# EAGLE design STM32L4xx-v1.2.0 (EAGLE 9.3.1)

## Sheet 1 of 2
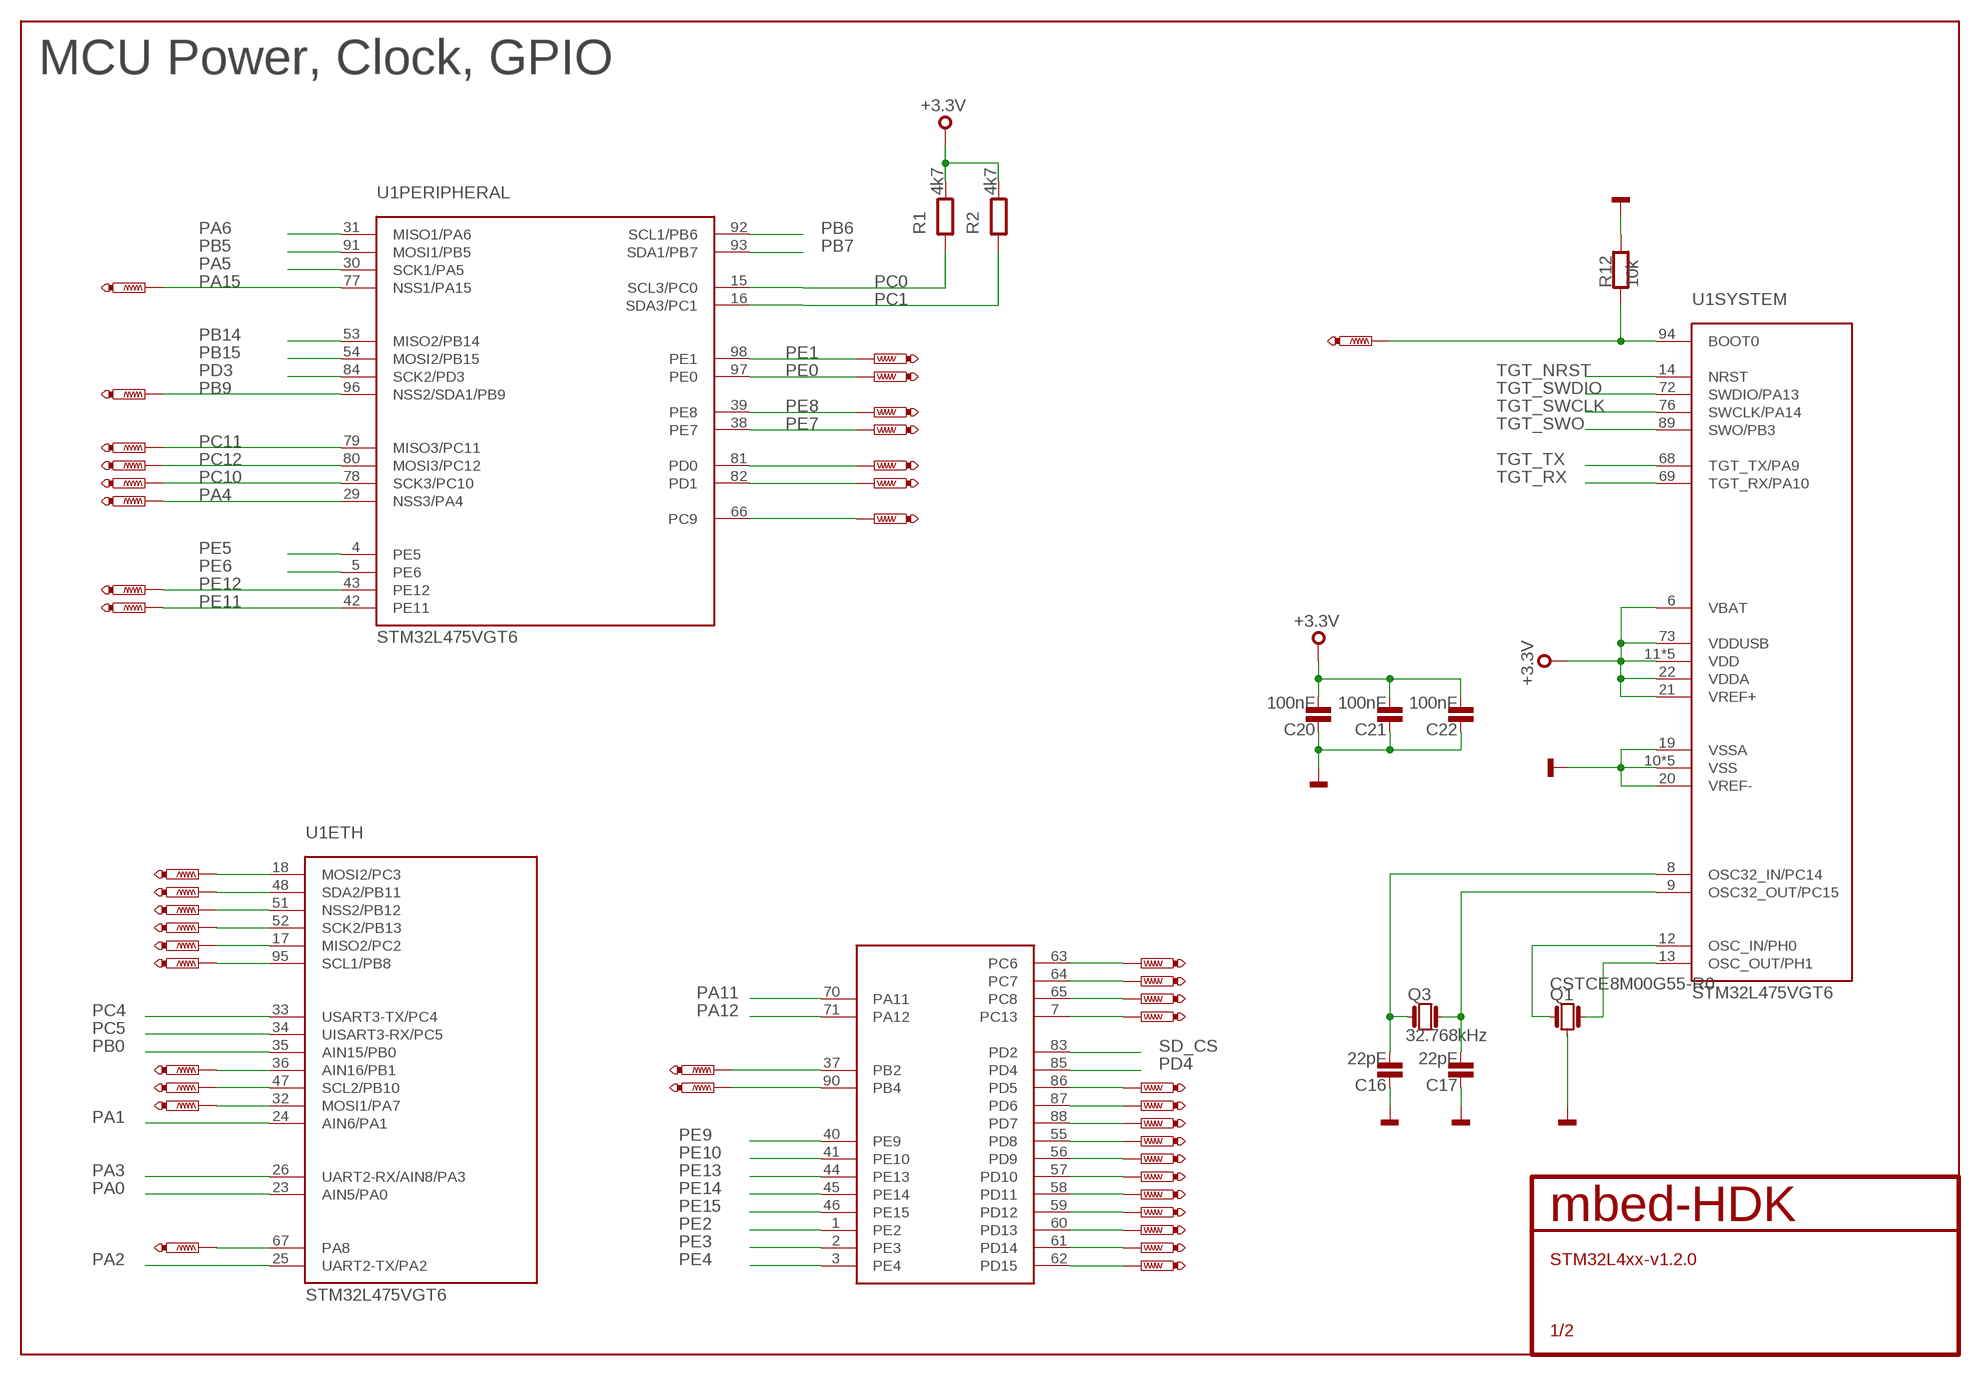
[diagram p0: schematic, sheet 1]

### Parts
C16  22pF  C0603  [0603]
C17  22pF  C0603  [0603]
C20  100nF  C0402  [0402]
C21  100nF  C0402  [0402]
C22  100nF  C0402  [0402]
Q1  CSTCE8M00G55-R0  [CSTCE8M00G55-R0]
Q3  32.768kHz  GENERIC-CRYSTAL_FC135  [FC135]
R1  4k7  R0402  [0402]
R2  4k7  R0402  [0402]
R12  10k  R0402  [0402]
TP3  PTR1TP06R  [TP06R]
TP4  PTR1TP06R  [TP06R]
TP5  PTR1TP06R  [TP06R]
TP6  PTR1TP06R  [TP06R]
TP7  PTR1TP06R  [TP06R]
TP8  PTR1TP06R  [TP06R]
TP9  PTR1TP06R  [TP06R]
TP10  PTR1TP06R  [TP06R]
TP11  PTR1TP06R  [TP06R]
TP12  PTR1TP06R  [TP06R]
TP13  PTR1TP06R  [TP06R]
TP14  PTR1TP06R  [TP06R]
TP15  PTR1TP06R  [TP06R]
TP16  PTR1TP06R  [TP06R]
TP17  PTR1TP06R  [TP06R]
TP18  PTR1TP06R  [TP06R]
TP19  PTR1TP06R  [TP06R]
TP20  PTR1TP06R  [TP06R]
TP21  PTR1TP06R  [TP06R]
TP22  PTR1TP06R  [TP06R]
TP23  PTR1TP06R  [TP06R]
TP24  PTR1TP06R  [TP06R]
TP25  PTR1TP06R  [TP06R]
TP26  PTR1TP06R  [TP06R]
TP27  PTR1TP06R  [TP06R]
TP28  PTR1TP06R  [TP06R]
TP29  PTR1TP06R  [TP06R]
TP30  PTR1TP06R  [TP06R]
TP31  PTR1TP06R  [TP06R]
TP32  PTR1TP06R  [TP06R]
TP33  PTR1TP06R  [TP06R]
TP34  PTR1TP06R  [TP06R]
TP35  PTR1TP06R  [TP06R]
TP36  PTR1TP06R  [TP06R]
TP37  PTR1TP06R  [TP06R]
TP38  PTR1TP06R  [TP06R]
TP39  PTR1TP06R  [TP06R]
TP40  PTR1TP06R  [TP06R]
TP41  PTR1TP06R  [TP06R]
TP42  PTR1TP06R  [TP06R]
TP43  PTR1TP06R  [TP06R]
TP44  PTR1TP06R  [TP06R]
TP45  PTR1TP06R  [TP06R]
U1  STM32L475VGT6  [QFP50P1600X1600X160-100N]

### Nets
+3.3V: C20.2 C21.2 C22.2 R1.2 R2.2 U1.6(SYSTEM:VBAT) U1.11(SYSTEM:VDD) U1.21(SYSTEM:VREF+) U1.22(SYSTEM:VDDA) U1.28(SYSTEM:VDD) U1.50(SYSTEM:VDD) U1.73(SYSTEM:VDDUSB) U1.75(SYSTEM:VDD) U1.100(SYSTEM:VDD) ; also sheet 2
GND: C16.1 C17.1 C20.1 C21.1 C22.1 Q1.2 R12.2 U1.10(SYSTEM:VSS) U1.19(SYSTEM:VSSA) U1.20(SYSTEM:VREF-) U1.27(SYSTEM:VSS) U1.49(SYSTEM:VSS) U1.74(SYSTEM:VSS) U1.99(SYSTEM:VSS) ; also sheet 2
N$1: TP5.TP U1.55(GPIO:PD8)
N$2: TP21.TP U1.62(GPIO:PD15)
N$3: R12.1 TP6.TP U1.94(SYSTEM:BOOT0)
N$4: TP26.TP U1.37(GPIO:PB2)
N$5: TP25.TP U1.7(GPIO:PC13)
N$6: TP27.TP U1.18(ETH:MOSI2/PC3)
N$7: TP28.TP U1.48(ETH:SDA2/PB11)
N$8: TP3.TP U1.81(PERIPHERAL:PD0)
N$9: TP29.TP U1.51(ETH:NSS2/PB12)
N$10: TP30.TP U1.52(ETH:SCK2/PB13)
N$11: Q1.1 U1.12(SYSTEM:OSC_IN/PH0)
N$12: Q1.3 U1.13(SYSTEM:OSC_OUT/PH1)
N$13: C17.2 Q3.X2 U1.9(SYSTEM:OSC32_OUT/PC15)
N$14: TP31.TP U1.17(ETH:MISO2/PC2)
N$15: C16.2 Q3.X1 U1.8(SYSTEM:OSC32_IN/PC14)
N$16: TP4.TP U1.82(PERIPHERAL:PD1)
N$17: TP7.TP U1.66(PERIPHERAL:PC9)
N$18: TP32.TP U1.95(ETH:SCL1/PB8)
N$19: TP33.TP U1.67(ETH:PA8)
N$20: TP18.TP U1.88(GPIO:PD7)
N$21: TP11.TP U1.90(GPIO:PB4)
N$22: TP34.TP U1.36(ETH:AIN16/PB1)
N$23: TP20.TP U1.86(GPIO:PD5)
N$24: TP19.TP U1.87(GPIO:PD6)
N$25: TP17.TP U1.65(GPIO:PC8)
N$26: TP16.TP U1.64(GPIO:PC7)
N$27: TP36.TP U1.47(ETH:SCL2/PB10)
N$28: TP15.TP U1.63(GPIO:PC6)
N$29: TP12.TP U1.60(GPIO:PD13)
N$30: TP35.TP U1.32(ETH:MOSI1/PA7)
N$31: TP13.TP U1.56(GPIO:PD9)
N$32: TP10.TP U1.57(GPIO:PD10)
N$34: TP22.TP U1.58(GPIO:PD11)
N$35: TP23.TP U1.59(GPIO:PD12)
N$36: TP24.TP U1.61(GPIO:PD14)
PA0: U1.23(ETH:AIN5/PA0) ; also sheet 2
PA1: U1.24(ETH:AIN6/PA1) ; also sheet 2
PA2: U1.25(ETH:UART2-TX/PA2) ; also sheet 2
PA3: U1.26(ETH:UART2-RX/AIN8/PA3) ; also sheet 2
PA4: TP44.TP U1.29(PERIPHERAL:NSS3/PA4)
PA5: U1.30(PERIPHERAL:SCK1/PA5) ; also sheet 2
PA6: U1.31(PERIPHERAL:MISO1/PA6) ; also sheet 2
PA11: U1.70(GPIO:PA11) ; also sheet 2
PA12: U1.71(GPIO:PA12) ; also sheet 2
PA15: TP37.TP U1.77(PERIPHERAL:NSS1/PA15)
PB0: U1.35(ETH:AIN15/PB0) ; also sheet 2
PB5: U1.91(PERIPHERAL:MOSI1/PB5) ; also sheet 2
PB6: U1.92(PERIPHERAL:SCL1/PB6) ; also sheet 2
PB7: U1.93(PERIPHERAL:SDA1/PB7) ; also sheet 2
PB9: TP14.TP U1.96(PERIPHERAL:NSS2/SDA1/PB9)
PB14: U1.53(PERIPHERAL:MISO2/PB14) ; also sheet 2
PB15: U1.54(PERIPHERAL:MOSI2/PB15) ; also sheet 2
PC0: R1.1 U1.15(PERIPHERAL:SCL3/PC0) ; also sheet 2
PC1: R2.1 U1.16(PERIPHERAL:SDA3/PC1) ; also sheet 2
PC4: U1.33(ETH:USART3-TX/PC4) ; also sheet 2
PC5: U1.34(ETH:UISART3-RX/PC5) ; also sheet 2
PC10: TP43.TP U1.78(PERIPHERAL:SCK3/PC10) ; also sheet 2
PC11: TP41.TP U1.79(PERIPHERAL:MISO3/PC11)
PC12: TP42.TP U1.80(PERIPHERAL:MOSI3/PC12)
PD3: U1.84(PERIPHERAL:SCK2/PD3) ; also sheet 2
PD4: U1.85(GPIO:PD4) ; also sheet 2
PE0: TP39.TP U1.97(PERIPHERAL:PE0)
PE1: TP38.TP U1.98(PERIPHERAL:PE1)
PE2: U1.1(GPIO:PE2) ; also sheet 2
PE3: U1.2(GPIO:PE3) ; also sheet 2
PE4: U1.3(GPIO:PE4) ; also sheet 2
PE5: U1.4(PERIPHERAL:PE5) ; also sheet 2
PE6: U1.5(PERIPHERAL:PE6) ; also sheet 2
PE7: TP45.TP U1.38(PERIPHERAL:PE7)
PE8: TP40.TP U1.39(PERIPHERAL:PE8)
PE9: U1.40(GPIO:PE9) ; also sheet 2
PE10: U1.41(GPIO:PE10) ; also sheet 2
PE11: TP8.TP U1.42(PERIPHERAL:PE11)
PE12: TP9.TP U1.43(PERIPHERAL:PE12)
PE13: U1.44(GPIO:PE13) ; also sheet 2
PE14: U1.45(GPIO:PE14) ; also sheet 2
PE15: U1.46(GPIO:PE15) ; also sheet 2
SD_CS: U1.83(GPIO:PD2) ; also sheet 2
TGT_NRST: U1.14(SYSTEM:NRST) ; also sheet 2
TGT_RX: U1.69(SYSTEM:TGT_RX/PA10) ; also sheet 2
TGT_SWCLK: U1.76(SYSTEM:SWCLK/PA14) ; also sheet 2
TGT_SWDIO: U1.72(SYSTEM:SWDIO/PA13) ; also sheet 2
TGT_SWO: U1.89(SYSTEM:SWO/PB3) ; also sheet 2
TGT_TX: U1.68(SYSTEM:TGT_TX/PA9) ; also sheet 2

### Notes on the sheet
- MCU Power, Clock, GPIO

## Sheet 2 of 2
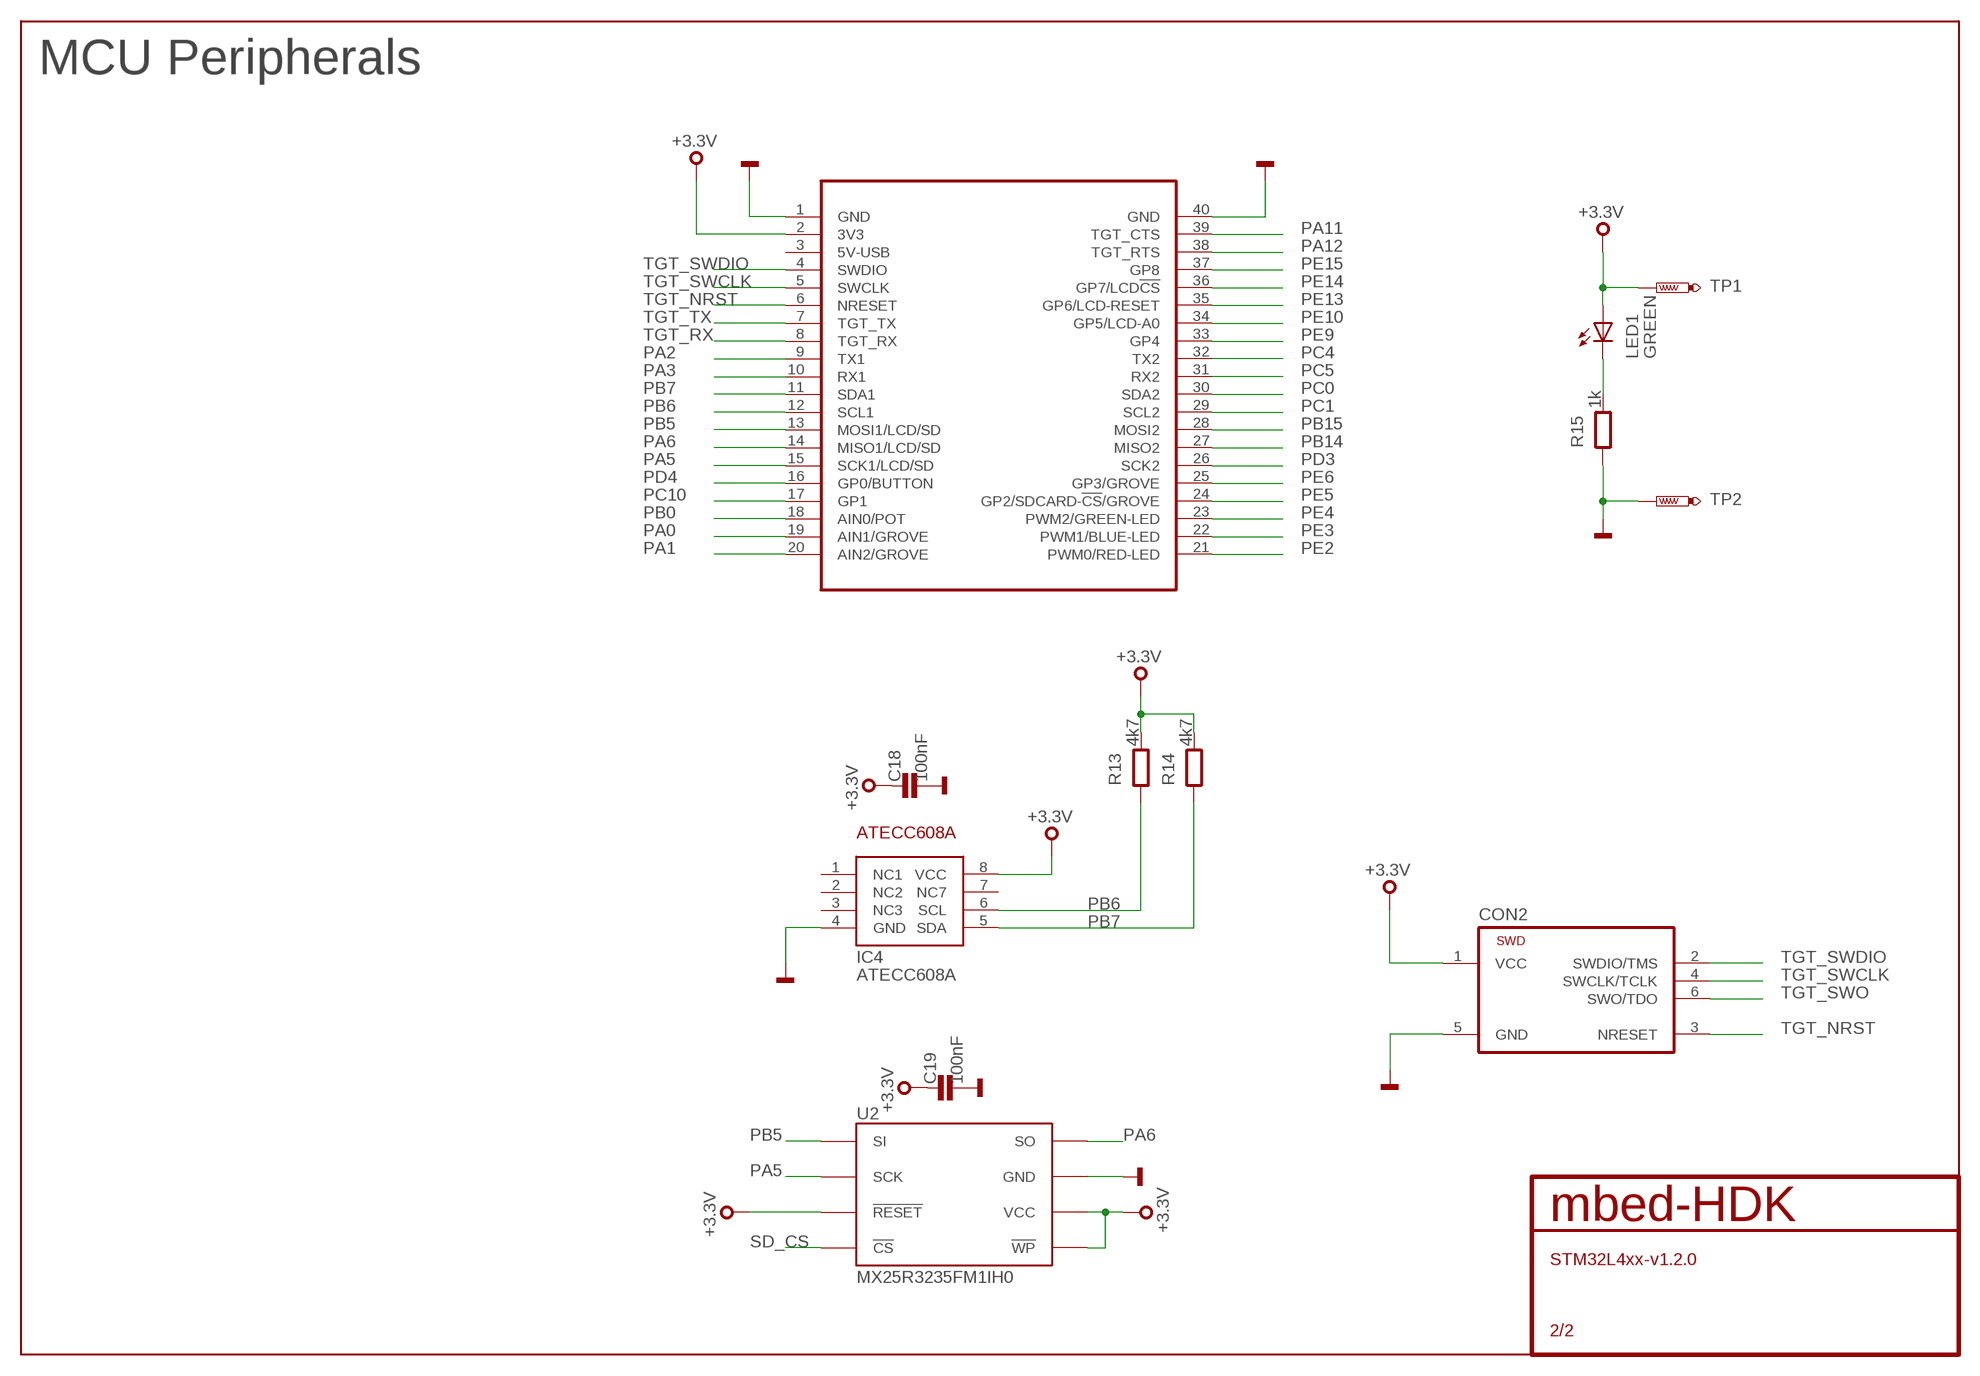
[diagram p1: schematic, sheet 2]

### Parts
C18  100nF  C0402  [0402]
C19  100nF  C0402  [0402]
CON2  TC2030-CTX-NL  [TC2030-CTX-NL]
IC4  ATECC608A  [SO8]
LED1  GREEN  SMD_LED0603  [CHIPLED_0603]
MOD1  MODULE_DAUGHTER  [MODULE_DAUGHTER]
R13  4k7  R0402  [0402]
R14  4k7  R0402  [0402]
R15  1k  R0603  [0603]
TP1  TEST_POINT-50R-PTH  [TP50-PTH]
TP2  TEST_POINT-50R-PTH  [TP50-PTH]
U2  MX25R3235FM1IH0  [SO8]

### Nets
+3.3V: C18.1 C19.1 CON2.1(VCC) IC4.8(VCC) LED1.A MOD1.2(3V3) R13.2 R14.2 TP1.TP U2.3(!WP) U2.7(!RESET) U2.8(VCC) ; also sheet 1
GND: C18.2 C19.2 CON2.5(GND) IC4.4(GND) MOD1.1(GND) MOD1.40(GND) R15.1 TP2.TP U2.4(GND) ; also sheet 1
PA0: MOD1.19(AIN1/GROVE) ; also sheet 1
PA1: MOD1.20(AIN2/GROVE) ; also sheet 1
PA2: MOD1.9(TX1) ; also sheet 1
PA3: MOD1.10(RX1) ; also sheet 1
PA5: MOD1.15(SCK1/LCD/SD) U2.6(SCK) ; also sheet 1
PA6: MOD1.14(MISO1/LCD/SD) U2.2(SO) ; also sheet 1
PA11: MOD1.39(TGT_CTS) ; also sheet 1
PA12: MOD1.38(TGT_RTS) ; also sheet 1
PA_1: LED1.C R15.2
PB0: MOD1.18(AIN0/POT) ; also sheet 1
PB5: MOD1.13(MOSI1/LCD/SD) U2.5(SI) ; also sheet 1
PB6: IC4.6(SCL) MOD1.12(SCL1) R13.1 ; also sheet 1
PB7: IC4.5(SDA) MOD1.11(SDA1) R14.1 ; also sheet 1
PB14: MOD1.27(MISO2) ; also sheet 1
PB15: MOD1.28(MOSI2) ; also sheet 1
PC0: MOD1.30(SDA2) ; also sheet 1
PC1: MOD1.29(SCL2) ; also sheet 1
PC4: MOD1.32(TX2) ; also sheet 1
PC5: MOD1.31(RX2) ; also sheet 1
PC10: MOD1.17(GP1) ; also sheet 1
PD3: MOD1.26(SCK2) ; also sheet 1
PD4: MOD1.16(GP0/BUTTON) ; also sheet 1
PE2: MOD1.21(PWM0/RED-LED) ; also sheet 1
PE3: MOD1.22(PWM1/BLUE-LED) ; also sheet 1
PE4: MOD1.23(PWM2/GREEN-LED) ; also sheet 1
PE5: MOD1.24(GP2/SDCARD-!CS!/GROVE) ; also sheet 1
PE6: MOD1.25(GP3/GROVE) ; also sheet 1
PE9: MOD1.33(GP4) ; also sheet 1
PE10: MOD1.34(GP5/LCD-A0) ; also sheet 1
PE13: MOD1.35(GP6/LCD-RESET) ; also sheet 1
PE14: MOD1.36(GP7/LCD!CS) ; also sheet 1
PE15: MOD1.37(GP8) ; also sheet 1
SD_CS: U2.1(!CS) ; also sheet 1
TGT_NRST: CON2.3(NRESET) MOD1.6(NRESET) ; also sheet 1
TGT_RX: MOD1.8(TGT_RX) ; also sheet 1
TGT_SWCLK: CON2.4(SWCLK/TCLK) MOD1.5(SWCLK) ; also sheet 1
TGT_SWDIO: CON2.2(SWDIO/TMS) MOD1.4(SWDIO) ; also sheet 1
TGT_SWO: CON2.6(SWO/TDO) ; also sheet 1
TGT_TX: MOD1.7(TGT_TX) ; also sheet 1
Unconnected: IC4.1(NC1) IC4.2(NC2) IC4.3(NC3) IC4.7(NC7) MOD1.3(5V-USB)

### Notes on the sheet
- MCU Peripherals

## Library data of the parts
C16-C22 = mbed-HDK-RLC:C: Capacitor
CON2 = mbed-HDK-Connector:TC2030-CTX: Tag-Connect In Circuit Programming & Debug Cable 6 Pin
IC4 = mbed-HDK-MF-ATMEL:ATECC608A
LED1 = mbed-HDK-Optical:SMD_LED: LED SMD, Colour Red; MF: Wurth Electronics Inc; MFN: 150060RS75000; OC-DIGIKEY: 732-4978-1-ND; OC-MOUSER: 710-150060RS75000; OC-NEWARK: 2322071
MOD1 = mbed-HDK-misc-Board:MODULE_DAUGHTER
Q1 = mbed-HDK-Oscillator:CSTCE8M00G55-R0: Resonator Cermanic, Murata 8MHz 33pF; MF: Murata; MFN: CSTCE8M00G55-R0; OC-DIGIKEY: 490-1195-1-ND; OC-MOUSER: 81-CSTCE8M00G55-R0; OC-NEWARK: 2443270
Q3 = mbed-HDK-Oscillator:GENERIC-CRYSTAL: GENERIC Crystal
R1 R2 R12-R15 = mbed-HDK-RLC:R: Resistor
TP1 TP2 = mbed-HDK-Test:TEST_POINT
TP3-TP45 = mbed-HDK-Test:PTR1: TEST PIN
U1 = SnapEDA:STM32L475VGT6
U2 = mbed-HDK-IC:MX25R3235FM1IH0: Serial Flash 32 Mb 80 Mhz; MF: Macronix; MFN: MX25R3235FM1IH0; OC-DIGIKEY: 1092-1175-ND

## Board
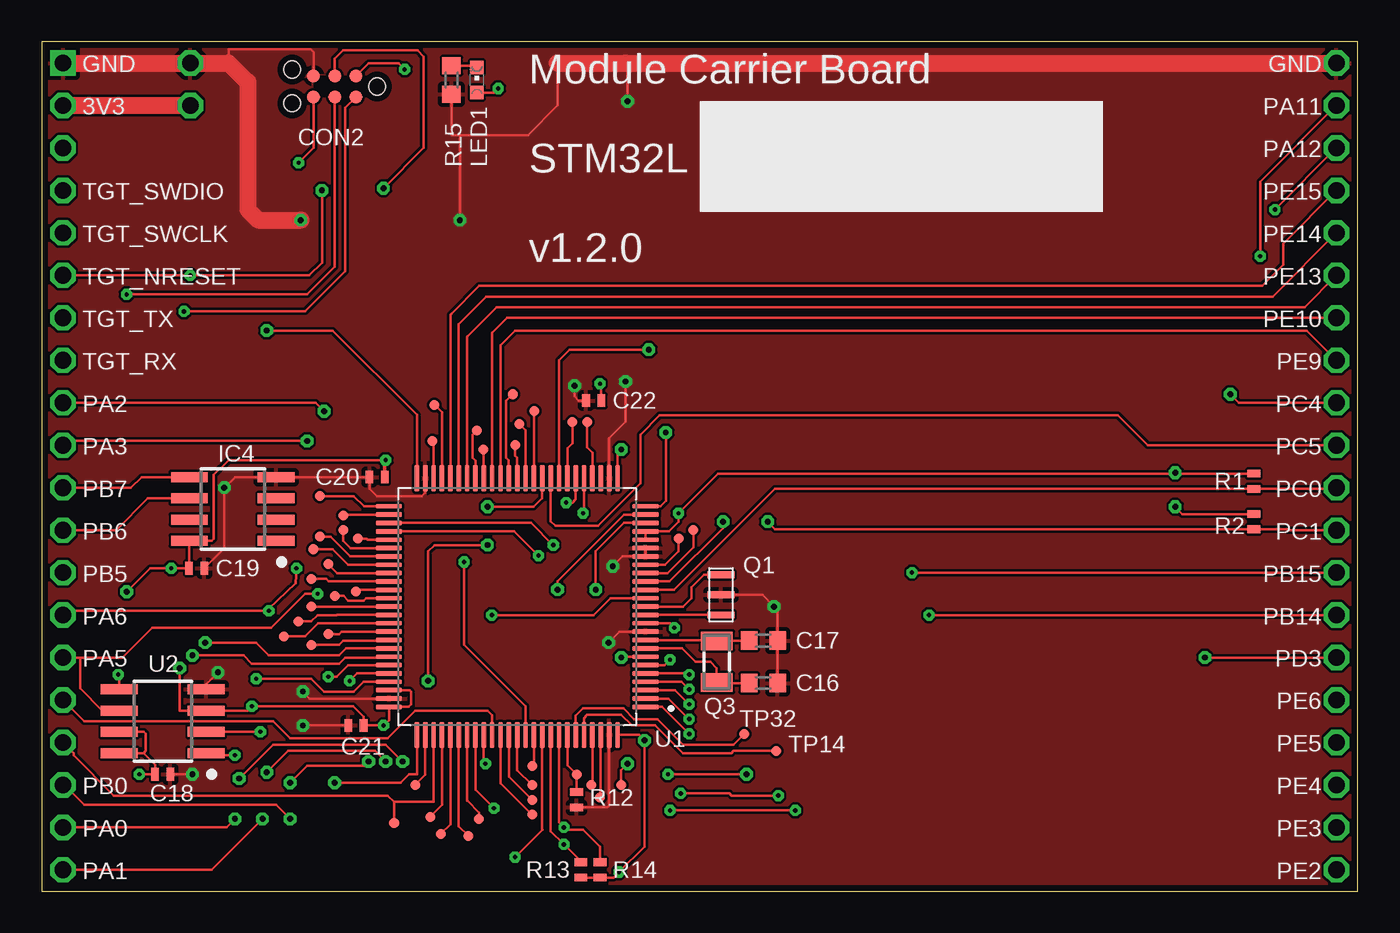
[diagram p2: board, top side]
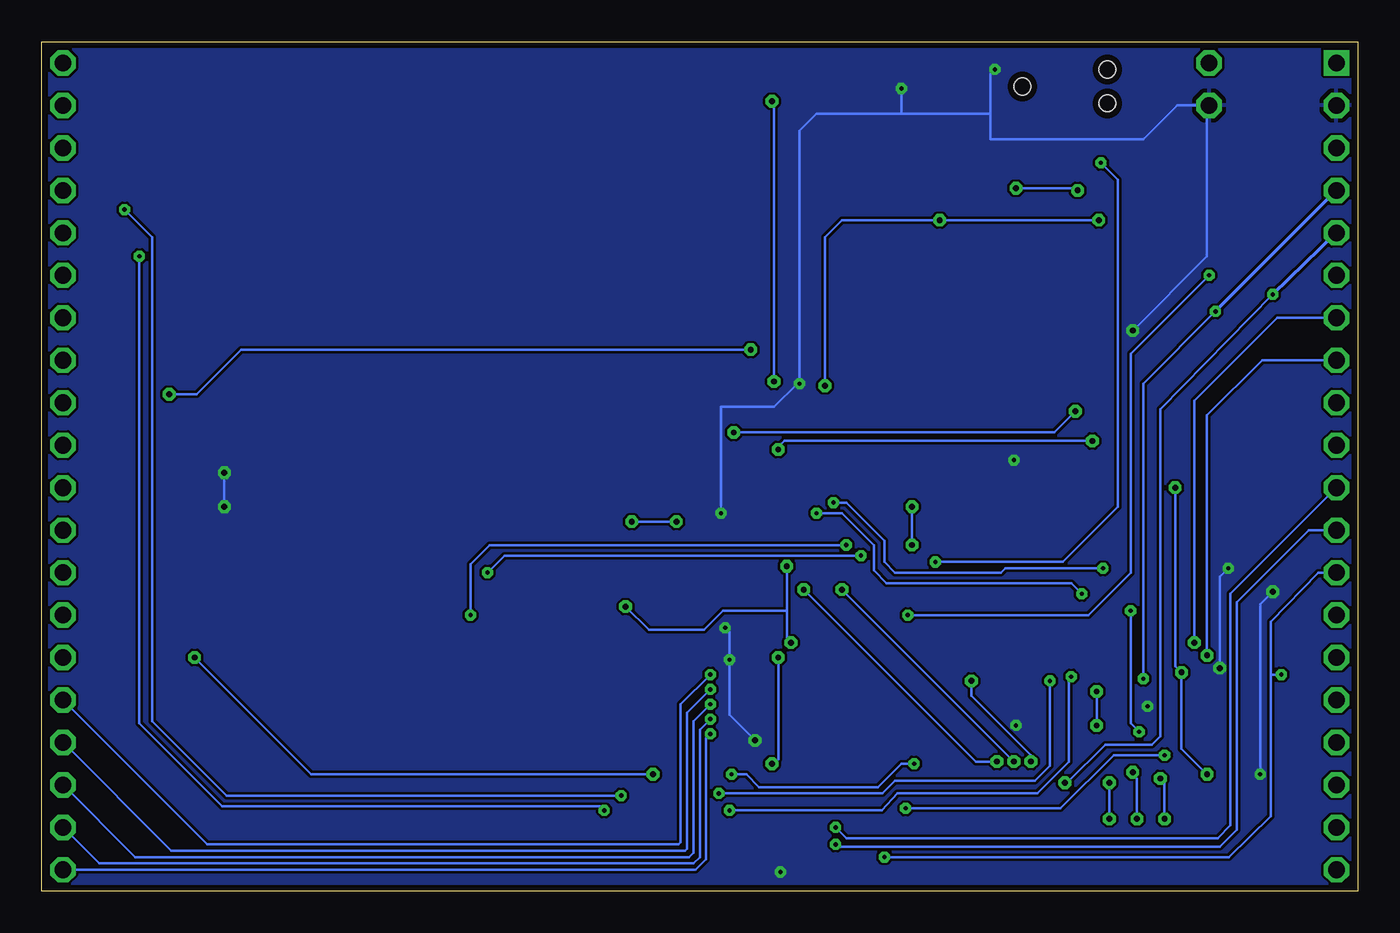
[diagram p3: board, bottom side, seen from below]

Size 78.74 x 50.8 mm. Coordinates in mm from the lower left corner, seen from the top.
Copper layers ((1*16)): Top 0.035mm / dielectric 0.8mm / Bottom 0.035mm
Design rules "mbed-HDK-6-6-2-layer": minimum track width 6mil, minimum drill 9mil, track to track 6mil, track to pad 6mil, pad to pad 6mil, via to via 6mil, smd to smd 6mil, copper to edge 15mil, drill to drill 8mil, minimum pad ring 10mil, minimum via ring 8mil, stop-mask expansion 4mil, vias tented up to drill 0mil, thermal gap 10mil

### Footprints (pad centres in the part's own frame; a part is rotated, then mirrored left to right if it is on the bottom)
0603 = smd 1 x 1.1: 1 -0.85,0; 2 0.85,0
0402 = smd 0.457 x 0.762: 1 -0.457,0; 2 0.457,0
TC2030-CTX-NL = smd 0.787 x 0.787: 1 -1.27,-0.635; 2 -1.27,0.635; 3 0,-0.635; 4 0,0.635; 5 1.27,-0.635; 6 1.27,0.635 | hole 0.991: -2.54,0; 2.54,1.016; 2.54,-1.016
SO8 = smd 0.6 x 2.2: 1 -1.905,-2.6; 2 -0.635,-2.6; 3 0.635,-2.6; 4 1.905,-2.6; 5 1.905,2.6; 6 0.635,2.6; 7 -0.635,2.6; 8 -1.905,2.6
CHIPLED_0603 = smd 0.8 x 0.8: A 0,-0.75; C 0,0.75
MODULE_DAUGHTER = drill 1 square: 1 0,0 | drill 1 octagon: 2 0,-2.54; 3 0,-5.08; 4 0,-7.62; 5 0,-10.16; 6 0,-12.7; 7 0,-15.24; 8 0,-17.78; 9 0,-20.32; 10 0,-22.86; 11 0,-25.4; 12 0,-27.94; 13 0,-30.48; 14 0,-33.02; 15 0,-35.56; 16 0,-38.1; 17 0,-40.64; 18 0,-43.18; 19 0,-45.72; 20 0,-48.26; 21 76.2,-48.26; 22 76.2,-45.72; 23 76.2,-43.18; 24 76.2,-40.64; 25 76.2,-38.1; 26 76.2,-35.56; 27 76.2,-33.02; 28 76.2,-30.48; 29 76.2,-27.94; 30 76.2,-25.4; 31 76.2,-22.86; 32 76.2,-20.32; 33 76.2,-17.78; 34 76.2,-15.24; 35 76.2,-12.7; 36 76.2,-10.16; 37 76.2,-7.62; 38 76.2,-5.08; 39 76.2,-2.54; 40 76.2,0
CSTCE8M00G55-R0 = smd 0.4 x 1.6: 1 2.4,0; 2 1.2,0; 3 0,0
FC135 = smd 1.1 x 1.9: X1 -1.25,0; X2 1.25,0
TP50-PTH = drill 1 octagon: TP 0,0
TP06R = smd 0.6 x 0.6: TP 0,0
QFP50P1600X1600X160-100N = smd 1.56 x 0.28: 1 -7.68,6; 2 -7.68,5.5; 3 -7.68,5; 4 -7.68,4.5; 5 -7.68,4; 6 -7.68,3.5; 7 -7.68,3; 8 -7.68,2.5; 9 -7.68,2; 10 -7.68,1.5; 11 -7.68,1; 12 -7.68,0.5; 13 -7.68,0; 14 -7.68,-0.5; 15 -7.68,-1; 16 -7.68,-1.5; 17 -7.68,-2; 18 -7.68,-2.5; 19 -7.68,-3; 20 -7.68,-3.5; 21 -7.68,-4; 22 -7.68,-4.5; 23 -7.68,-5; 24 -7.68,-5.5; 25 -7.68,-6; 51 7.68,-6; 52 7.68,-5.5; 53 7.68,-5; 54 7.68,-4.5; 55 7.68,-4; 56 7.68,-3.5; 57 7.68,-3; 58 7.68,-2.5; 59 7.68,-2; 60 7.68,-1.5; 61 7.68,-1; 62 7.68,-0.5; 63 7.68,0; 64 7.68,0.5; 65 7.68,1; 66 7.68,1.5; 67 7.68,2; 68 7.68,2.5; 69 7.68,3; 70 7.68,3.5; 71 7.68,4; 72 7.68,4.5; 73 7.68,5; 74 7.68,5.5; 75 7.68,6 | smd 0.28 x 1.56: 26 -6,-7.68; 27 -5.5,-7.68; 28 -5,-7.68; 29 -4.5,-7.68; 30 -4,-7.68; 31 -3.5,-7.68; 32 -3,-7.68; 33 -2.5,-7.68; 34 -2,-7.68; 35 -1.5,-7.68; 36 -1,-7.68; 37 -0.5,-7.68; 38 0,-7.68; 39 0.5,-7.68; 40 1,-7.68; 41 1.5,-7.68; 42 2,-7.68; 43 2.5,-7.68; 44 3,-7.68; 45 3.5,-7.68; 46 4,-7.68; 47 4.5,-7.68; 48 5,-7.68; 49 5.5,-7.68; 50 6,-7.68; 76 6,7.68; 77 5.5,7.68; 78 5,7.68; 79 4.5,7.68; 80 4,7.68; 81 3.5,7.68; 82 3,7.68; 83 2.5,7.68; 84 2,7.68; 85 1.5,7.68; 86 1,7.68; 87 0.5,7.68; 88 0,7.68; 89 -0.5,7.68; 90 -1,7.68; 91 -1.5,7.68; 92 -2,7.68; 93 -2.5,7.68; 94 -3,7.68; 95 -3.5,7.68; 96 -4,7.68; 97 -4.5,7.68; 98 -5,7.68; 99 -5.5,7.68; 100 -6,7.68

### Placement (x,y rotation side)
C16  43.18,12.45 180 top
C17  43.18,14.99 180 top
C18  7.24,6.99 0 top
C19  9.27,19.3 0 top
C20  20.07,24.77 0 top
C21  18.8,9.91 0 top
C22  33.02,29.34 0 top
CON2  17.53,48.13 180 top
IC4  11.43,22.86 90 top
LED1  26.04,48.51 0 top
MOD1  1.27,49.53 0 top
Q1  40.64,18.92 270 top
Q3  40.39,13.72 90 top
R1  72.52,24.51 90 top
R2  72.52,22.1 90 top
R12  32,5.46 270 top
R13  32.26,1.27 270 top
R14  33.4,1.27 270 top
R15  24.51,48.51 90 top
TP1  8.89,46.99 0 top
TP2  8.89,49.53 0 top
TP3  25.53,3.3 0 top
TP4  26.16,4.32 0 top
TP5  18.92,21.08 0 top
TP6  32,6.99 0 top
TP7  17.14,15.37 0 top
TP8  26.42,26.42 0 top
TP9  26.04,27.56 0 top
TP10  16.64,21.21 0 top
TP11  29.34,7.49 0 top
TP12  16.13,18.67 0 top
TP13  18.03,21.59 0 top
TP14  43.94,8.38 0 top
TP15  16.13,17.02 0 top
TP16  15.37,16.13 0 top
TP17  14.48,15.24 0 top
TP18  29.34,6.35 270 top
TP19  29.34,5.46 270 top
TP20  29.34,4.57 270 top
TP21  17.53,17.65 0 top
TP22  16.26,20.45 0 top
TP23  17.14,19.56 0 top
TP24  18.8,17.91 0 top
TP25  34.67,6.35 0 top
TP26  28.57,27.94 0 top
TP27  38.1,21.08 0 top
TP28  23.37,26.92 0 top
TP29  16.64,23.62 0 top
TP30  18.03,22.48 0 top
TP31  38.99,21.59 0 top
TP32  42.04,9.4 0 top
TP33  16.13,14.73 0 top
TP34  29.46,28.7 0 top
TP35  31.75,28.07 0 top
TP36  23.5,29.08 0 top
TP37  22.35,6.35 0 top
TP38  33.4,5.59 0 top
TP39  32.89,6.35 0 top
TP40  28.19,29.72 0 top
TP41  23.24,4.45 0 top
TP42  23.88,3.43 0 top
TP43  21.08,4.06 0 top
TP44  32.64,28.07 0 top
TP45  28.32,26.67 0 top
U1  28.45,17.02 180 top
U2  7.24,10.16 90 top

### Tracks (layer width: path | path; a pad name or v marks a point on that pad's centre or on a via)
+3.3V  (via drill 0.25, 0.35)
  Top 0.152: LED1.A 27.06,47.76 v27.3,48.01 | CON2.1 19.56,49.53 21.34,49.53 v21.72,49.15 | C22.2 33.48,30.28 v33.4,30.35 | v37.59,13.84 37.27,13.52 U1.6 | v37.85,15.75 37.58,16.02 U1.11 | R13.2 R14.2 34.21,0.81 v34.54,1.14 36.07,2.67 v36.07,9.02 35.75,9.34 U1.100 | U2.7 6.1,9.53 6.22,9.4 6.22,8.38 6.1,8.26 | 6.1,8.26 U2.8 | 6.1,8.26 6.78,7.57 C18.1 v5.84,6.99 | R1.2 67.82,24.97 | 67.82,24.97 40.46,24.97 v38.1,22.61 38.1,22.08 37.54,21.52 U1.22 U1.21 | R2.2 68.25,22.55 v67.82,22.99 | v67.82,25.02 67.82,24.97 | v8.26,13.34 8.26,10.79 U2.3 12.32,10.79 v12.57,11.05 18.62,11.05 19.25,10.41 C21.2 v20.45,9.91 20.77,10.23 U1.75 21.94,11.02 22.1,11.18 22.1,11.94 22.02,12.02 U1.73 | v5.08,17.91 6.48,19.3 v7.75,19.3 C19.1 8.83,19.33 IC4.8 10.16,20.95 10.29,21.08 10.29,24.89 11.18,25.78 v20.57,25.78 | v13.46,33.53 17.4,33.53 22.45,28.48 U1.50
  Top 0.203: v20.57,25.78 20.52,25.73 C20.2
  Top 1.016: MOD1.2 TP1.TP
  Bottom 0.152: v37.85,15.75 37.59,15.49 v37.59,13.84 37.59,10.54 v36.07,9.02 | v67.82,25.02 v67.82,22.99 | v21.72,49.15 21.97,48.9 21.97,46.48 | 21.97,46.48 27.3,46.48 | 27.3,46.48 32.38,46.48 33.4,45.47 v33.4,30.35 33.53,30.35 34.92,28.96 38.1,28.96 v38.1,22.61 | 27.3,46.48 v27.3,48.01 | TP1.TP 9.02,46.99 | 9.02,46.99 10.79,46.99 12.83,44.96 21.97,44.96 21.97,46.48 | v8.26,13.34 8.26,18.8 v7.75,19.3 | v5.08,17.91 5.84,17.14 v5.84,6.99 | v13.46,33.53 9.02,37.97 9.02,46.99
  pour Bottom: 0,0 78.74,0 78.74,50.8 0,50.8
GND  (via drill 0.35)
  Top 0.152: R15.1 24.51,45.21 25.02,45.21 | 25.02,45.21 29.08,45.21 30.86,46.99 30.86,49.53 | Q1.2 43.11,17.72 v43.81,17.02 44.03,16.8 C17.1 C16.1 | v34.92,30.48 34.92,28.07 33.95,27.09 U1.27 | v35.05,47.24 35.05,49.4 34.92,49.53 | C22.1 32.13,29.34 31.88,29.59 v31.88,30.23 | CON2.5 16.26,50.16 16.08,50.34 11.18,50.34 11.18,49.53 | U2.4 9.84,12.38 v10.54,13.08 | C18.2 v9.02,6.99 | C19.2 10.92,20.5 v10.92,24.13 11.56,24.77 IC4.4 C20.1 19.61,24.08 20.07,23.62 22.73,23.62 22.95,23.84 U1.49 | v33.91,14.86 34.57,15.52 U1.10 | v34.16,19.43 34.75,20.02 U1.19 U1.20 | R12.2 33.83,5 33.95,5.12 U1.99 | v25.02,40.13 25.02,45.21 | C21.1 v15.62,9.91 | v15.62,11.94 16.04,11.52 U1.74
  Top 1.016: MOD1.1 TP2.TP 11.18,49.53 12.32,48.39 12.32,40.77 12.95,40.13 v15.49,40.13 | 30.86,49.53 34.92,49.53 MOD1.40
  Bottom 0.152: v34.92,30.48 34.92,47.12 v35.05,47.24 | v15.49,40.13 v25.02,40.13 30.86,40.13 31.88,39.12 v31.88,30.23 | v10.92,24.13 10.92,13.46 v10.54,13.08 10.54,8.51 v9.02,6.99 | v34.16,19.43 34.16,16.76 | 34.16,16.76 34.16,15.11 v33.91,14.86 | v43.81,17.02 42.42,15.62 39.12,15.62 37.97,16.76 34.16,16.76 | v15.62,11.94 v15.62,9.91
  pour Top: 0,0 0,50.8 78.74,50.8 78.74,0
N$1
  Top 0.152: TP5.TP 19.43,21.08 19.5,21.02 U1.55
N$2
  Top 0.152: TP21.TP 18.05,17.65 18.32,17.38 19.27,17.38 19.41,17.52 U1.62
N$3
  Top 0.152: R12.1 TP6.TP 31.45,7.54 U1.94
N$4
  Top 0.152: TP26.TP 28.95,27.57 U1.37
N$5  (via drill 0.35)
  Top 0.152: TP25.TP 34.67,7.24 v35.05,7.62 | U1.7 34.72,14.02 v34.67,13.97
  Bottom 0.152: v35.05,7.62 34.92,7.62 34.67,7.87 v34.67,13.97
N$6
  Top 0.152: TP27.TP 38.1,20.32 37.3,19.52 U1.18
N$7
  Top 0.152: TP28.TP 23.45,26.84 U1.48
N$8
  Top 0.152: TP3.TP 24.95,3.88 U1.81
N$9
  Top 0.152: TP29.TP 18.67,23.62 19.27,23.02 U1.51
N$10
  Top 0.152: TP30.TP 18.07,22.52 U1.52
N$11
  Top 0.152: Q1.1 U1.12
N$12
  Top 0.152: Q1.3 39.62,18.92 38.86,18.16 38.86,17.53 38.35,17.02 U1.13
N$13
  Top 0.152: C17.2 40.41,14.99 Q3.X2 40.33,15.02 U1.9
N$14
  Top 0.152: TP31.TP 38.99,20.57 37.43,19.02 U1.17
N$15
  Top 0.152: C16.2 40.41,12.45 Q3.X1 40.39,13.34 40.01,13.72 39.12,13.72 38.31,14.52 U1.8
N$16
  Top 0.152: TP4.TP 26.16,4.7 25.46,5.4 25.45,5.41 U1.82
N$17
  Top 0.152: U1.66 17.93,15.52 17.78,15.37 TP7.TP
N$18
  Top 0.152: TP32.TP 41.4,8.76 38.35,8.76 36.83,10.29 35.43,10.29 34.8,10.92 32.38,10.92 31.95,10.48 U1.95
N$19
  Top 0.152: U1.67 20.74,14.99 18.03,14.99 17.78,14.73 TP33.TP
N$20
  Top 0.152: TP18.TP 28.45,7.24 U1.88
N$21
  Top 0.152: U1.90 29.45,7.6 TP11.TP
N$22
  Top 0.152: U1.36 29.45,28.69 TP34.TP
N$23
  Top 0.152: TP20.TP 27.45,6.46 U1.86
N$24
  Top 0.152: TP19.TP 27.95,6.85 U1.87
N$25
  Top 0.152: TP17.TP 15.75,15.24 16.53,16.02 U1.65
N$26
  Top 0.152: U1.64 17.66,16.52 17.65,16.51 16.51,16.51 16.13,16.13 TP16.TP
N$27
  Top 0.152: TP36.TP 23.95,28.63 U1.47
N$28
  Top 0.152: U1.63 TP15.TP
N$29
  Top 0.152: U1.60 17.17,18.52 17.02,18.67 TP12.TP
N$30
  Top 0.152: U1.32 31.45,26.5 31.75,26.8 TP35.TP
N$31
  Top 0.152: U1.56 18.47,20.52 18.03,20.95 TP13.TP
N$32
  Top 0.152: TP10.TP 17.27,21.21 18.46,20.02 U1.57
N$34
  Top 0.152: TP22.TP 17.4,20.45 18.33,19.52 U1.58
N$35
  Top 0.152: TP23.TP 17.68,19.02 U1.59
N$36
  Top 0.152: TP24.TP 18.86,17.97 18.91,18.02 U1.61
PA0  (via drill 0.35)
  Top 0.152: v11.81,6.73 13.84,8.76 20.57,8.76 v21.59,7.75 | v33.15,18.03 33.15,20.32 34.84,22.02 U1.23 | MOD1.19 11.05,3.81 v11.56,4.32
  Bottom 0.152: v11.81,6.73 11.56,6.48 v11.56,4.32 | v21.59,7.75 22.86,7.75 v33.15,18.03
PA1  (via drill 0.35)
  Top 0.152: v13.46,7.11 14.73,8.38 19.94,8.38 v20.57,7.75 | v30.86,18.03 30.86,18.54 34.84,22.52 U1.24 | MOD1.20 10.16,1.27 v13.21,4.32
  Bottom 0.152: v13.46,7.11 13.46,6.99 13.21,6.73 v13.21,4.32 | v30.86,18.03 v20.57,7.75
PA2  (via drill 0.35)
  Top 0.152: v37.34,27.43 37.34,23.34 37.02,23.02 U1.25 | MOD1.9 16.38,29.21 v16.89,28.7
  Bottom 0.152: v37.34,27.43 18.16,27.43 v16.89,28.7
PA3  (via drill 0.35)
  Top 0.152: v34.67,26.42 34.45,26.19 U1.26 | v15.88,26.92 1.52,26.92 MOD1.10
  Bottom 0.152: v34.67,26.42 34.67,26.54 34.29,26.92 v15.88,26.92
PA4
  Top 0.152: TP44.TP 32.64,26.54 32.95,26.23 U1.29
PA5  (via drill 0.25)
  Top 0.152: v32.38,22.61 32.45,22.67 U1.30 | 2.29,13.97 4.83,13.97 6.6,15.75 13.72,15.75 15.75,17.78 v16.51,17.78 | 2.29,13.97 MOD1.15 | 2.29,13.97 2.29,12.13 3.62,10.79 U2.6
  Bottom 0.152: v32.38,22.61 30.86,22.61 28.96,20.7 28.96,19.18 28.19,18.41 17.14,18.41 v16.51,17.78
PA6  (via drill 0.25)
  Top 0.152: v31.37,23.24 31.75,23.24 31.95,23.44 U1.31 | v15.24,19.3 15.2,18.42 13.59,16.89 v13.59,16.76 1.52,16.76 MOD1.14 | v13.08,9.53 U2.2
  Bottom 0.152: v31.37,23.24 30.61,23.24 28.32,20.95 28.32,19.68 27.69,19.05 21.34,19.05 21.08,19.3 v15.24,19.3 | v13.59,16.76 13.59,10.03 v13.08,9.53
PA11  (via drill 0.25)
  Top 0.152: v17.14,12.83 17.65,12.83 18.34,13.52 U1.70 | v45.09,4.83 v37.59,4.83 | v72.9,37.97 72.9,42.42 MOD1.39
  Bottom 0.152: v17.14,12.83 17.27,12.7 17.27,7.75 19.18,5.84 27.55,5.84 28.48,4.83 v37.59,4.83 | v45.09,4.83 45.34,5.08 67.94,5.08 72.9,10.03 v72.9,37.97
PA12  (via drill 0.25)
  Top 0.152: v18.41,12.57 18.86,13.02 U1.71 | v44.07,5.71 41.27,5.71 41.15,5.84 v38.23,5.84 | MOD1.38 v73.79,40.77
  Bottom 0.152: v18.41,12.57 18.41,7.49 19.3,6.6 27.69,6.6 28.45,5.84 v38.23,5.84 | v44.07,5.71 67.69,5.71 72.14,10.16 72.14,39.12 v73.79,40.77
PA15
  Top 0.152: TP37.TP 22.95,6.95 U1.77
PA_1
  Top 0.152: R15.2 25.93,49.36 LED1.C
PB0  (via drill 0.35)
  Top 0.152: v14.86,6.48 15.88,7.49 19.3,7.49 v19.56,7.75 | v26.67,20.7 23.5,20.7 23.11,20.32 v23.11,12.57 | v26.67,22.99 29.44,22.99 29.95,23.5 U1.35 | MOD1.18 1.35,6.35 2.54,5.16 14.02,5.16 v14.86,4.32
  Bottom 0.152: v14.86,6.48 v14.86,4.32 | v19.56,7.75 19.56,8.13 23.11,11.68 v23.11,12.57 | v26.67,20.7 v26.67,22.99
PB5  (via drill 0.25)
  Top 0.152: U2.5 4.64,12.89 v4.57,12.95 | v28.32,2.03 29.97,3.68 29.95,3.71 U1.91
  Bottom 0.152: MOD1.13 2.37,19.05 5.21,16.12 5.21,12.95 | 5.21,12.95 5.21,4.47 7.71,2.03 v28.32,2.03 | 5.21,12.95 v4.57,12.95
PB6  (via drill 0.25)
  Top 0.152: IC4.6 6.35,23.5 4.45,21.59 MOD1.12 | R13.1 32.26,1.78 v31.24,2.79 30.45,3.59 U1.92
  Bottom 0.152: MOD1.12 2.92,21.59 7.24,17.27 7.24,3.68 8.26,2.67 31.11,2.67 v31.24,2.79
PB7  (via drill 0.25)
  Top 0.152: IC4.5 5.97,24.77 5.33,24.13 MOD1.11 | R14.1 33.4,2.67 32.38,3.68 31.37,3.68 v31.24,3.81 30.95,4.1 U1.93
  Bottom 0.152: MOD1.11 7.62,17.78 7.62,3.94 8.38,3.17 30.61,3.17 v31.24,3.81
PB9
  Top 0.152: TP14.TP 41.4,8.38 41.27,8.26 38.35,8.26 36.7,9.91 35.31,9.91 34.67,10.54 32.64,10.54 32.45,10.35 U1.96
PB14  (via drill 0.25)
  Top 0.152: v30.61,20.7 29.29,22.02 U1.53 | MOD1.27 v53.09,16.51
  Bottom 0.152: v53.09,16.51 53.09,19.56 51.94,20.7 v30.61,20.7
PB15  (via drill 0.25)
  Top 0.152: v29.72,20.07 28.27,21.52 U1.54 | MOD1.28 v52.07,19.05
  Bottom 0.152: v52.07,19.05 51.05,20.07 v29.72,20.07
PC0
  Top 0.152: U1.15 37.83,18.02 43.87,24.05 60.25,24.05 R1.1 77.39,24.05 MOD1.30
PC1  (via drill 0.35)
  Top 0.152: v40.77,22.1 40.77,21.72 37.57,18.52 U1.16 | v43.43,22.1 43.88,21.65 72.5,21.65 R2.1 74.5,21.64 74.55,21.59 MOD1.29
  Bottom 0.152: v40.77,22.1 v43.43,22.1
PC4  (via drill 0.35)
  Top 0.152: v36.32,32.38 31.58,32.38 30.95,31.75 U1.33 | MOD1.32 71.63,29.21 v71.12,29.72
  Bottom 0.152: v36.32,32.38 66.8,32.38 69.47,29.72 v71.12,29.72
PC5
  Top 0.152: MOD1.31 66.17,26.67 64.39,28.45 36.96,28.45 35.81,27.3 35.81,24.38 33.27,21.84 30.73,21.84 30.45,22.13 U1.34
PC10
  Top 0.152: 21.08,5.33 23.45,5.33 U1.78 | MOD1.17 1.91,8.26 1.91,8.13 4.32,5.71 20.7,5.71 21.08,5.33 | TP43.TP 21.08,5.33
PC11
  Top 0.152: TP41.TP 23.95,5.15 U1.79
PC12
  Top 0.152: TP42.TP 24.45,4 U1.80
PD3  (via drill 0.25, 0.35)
  Top 0.152: v42.16,6.99 v37.47,6.99 | MOD1.26 v69.6,13.97 | U1.84 26.45,7.71 v26.54,7.62
  Bottom 0.152: v26.54,7.62 27.3,7.62 28.7,6.22 35.81,6.22 36.58,6.99 v37.47,6.99 | v42.16,6.99 62.61,6.99 v69.6,13.97
PD4
  Top 0.152: MOD1.16 2.54,10.16 13.84,10.16 14.86,9.14 20.7,9.14 22.35,10.79 26.67,10.79 26.95,10.52 U1.85
PE0
  Top 0.152: U1.97 32.95,6.41 TP39.TP
PE1
  Top 0.152: U1.98 33.45,5.63 TP38.TP
PE2  (via drill 0.25)
  Top 0.152: v38.73,9.4 37.12,11.02 U1.1
  Bottom 0.152: MOD1.21 39.62,1.27 38.99,1.91 38.99,9.14 v38.73,9.4
PE3  (via drill 0.25)
  Top 0.152: v38.73,10.29 37.5,11.52 U1.2
  Bottom 0.152: MOD1.22 75.31,1.65 39.75,1.65 39.37,2.03 39.37,9.65 v38.73,10.29
PE4  (via drill 0.25)
  Top 0.152: v38.73,11.18 37.89,12.02 U1.3
  Bottom 0.152: MOD1.23 73.15,2.03 40.01,2.03 39.75,2.29 39.75,10.16 v38.73,11.18
PE5  (via drill 0.25)
  Top 0.152: v38.73,12.06 38.28,12.52 U1.4
  Bottom 0.152: v38.73,12.06 40.13,10.67 40.13,2.54 40.26,2.41 70.99,2.41 MOD1.24
PE6  (via drill 0.25)
  Top 0.152: v38.73,12.95 38.67,13.02 U1.5
  Bottom 0.152: v38.73,12.95 40.51,11.18 40.51,2.92 40.64,2.79 68.83,2.79 MOD1.25
PE7
  Top 0.152: U1.38 28.45,25.91 28.32,26.04 TP45.TP
PE8
  Top 0.152: U1.39 27.94,25.78 27.79,25.93 27.79,29.32 TP40.TP
PE9
  Top 0.152: MOD1.33 75.69,33.53 28.32,33.53 27.45,32.66 U1.40
PE10
  Top 0.152: MOD1.34 27.84,34.29 26.95,33.4 U1.41
PE11
  Top 0.152: TP8.TP 26.45,26.26 U1.42
PE12
  Top 0.152: TP9.TP 25.78,27.3 25.78,25.91 25.95,25.74 U1.43
PE13
  Top 0.152: MOD1.35 75.56,34.92 27.23,34.92 25.49,33.19 25.45,33.15 U1.44
PE14
  Top 0.152: MOD1.36 73.66,35.56 26.6,35.56 24.95,33.91 U1.45
PE15
  Top 0.152: MOD1.37 74.3,38.73 74.3,37.47 73.03,36.2 26.16,36.2 24.51,34.54 24.45,34.48 U1.46
SD_CS  (via drill 0.25)
  Top 0.152: v27.05,4.95 25.95,6.06 U1.83 | v11.56,8.13 9.97,8.13 U2.1
  Bottom 0.152: v11.56,8.13 14.61,8.13 17.78,4.95 v27.05,4.95
TGT_NRST  (via drill 0.25, 0.35)
  Top 0.152: v16.76,41.91 16.76,37.59 16,36.83 v8.89,36.83 MOD1.6 | v26.92,16.51 33.02,16.51 34.03,17.52 U1.14 | v20.45,42.04 22.86,44.45 22.86,49.91 22.48,50.29 18.03,50.29 17.53,49.78 CON2.3
  Bottom 0.152: v26.92,16.51 16.13,16.51 13.59,19.05 13.59,32.13 v8.89,36.83 | v20.45,42.04 16.89,42.04 v16.76,41.91
TGT_RX  (via drill 0.35)
  Top 0.152: U1.69 20.72,13.97 18.16,13.97 17.78,13.59 12.57,13.59 12.06,14.1 v9.02,14.1
  Bottom 0.152: v9.02,14.1 9.02,28.45 5.71,31.75 MOD1.8
TGT_SWCLK  (via drill 0.25, 0.35)
  Top 0.152: v5.08,35.69 15.88,35.69 17.53,37.34 CON2.4 | v17.53,6.48 21.46,6.48 21.97,6.99 22.45,6.99 U1.76
  Bottom 0.152: v5.08,35.69 11.81,28.83 11.81,9.27 12.32,8.76 15.11,8.76 17.4,6.48 v17.53,6.48
  Bottom 0.203: v5.08,35.69 MOD1.5
TGT_SWDIO  (via drill 0.25)
  Top 0.152: v12.83,12.7 16.13,12.7 16.89,11.94 18.67,11.94 19.25,12.52 U1.72 | CON2.2 18.16,46.86 18.16,37.08 15.75,34.67 v8.51,34.67
  Bottom 0.152: v8.51,34.67 12.83,30.35 v12.83,12.7
  Bottom 0.203: v8.51,34.67 MOD1.4
TGT_SWO  (via drill 0.25)
  Top 0.152: CON2.6 16.26,44.45 v15.37,43.56 | v25.27,19.68 25.27,14.73 28.95,11.06 U1.89
  Bottom 0.152: v25.27,19.68 17.65,19.68 14.35,22.99 14.35,42.55 v15.37,43.56
TGT_TX  (via drill 0.35)
  Top 0.152: v9.78,14.86 12.83,14.86 13.59,14.1 17.78,14.1 18.2,14.52 U1.68
  Bottom 0.152: v9.78,14.86 9.78,29.34 4.83,34.29 MOD1.7

### Text on the board
tPlace: GND / 3V3 / / TGT_SWDIO / TGT_SWCLK / TGT_NRESET / TGT_TX / TGT_RX / PA2 / PA3 / PB7 / PB6 / PB5 / PA6 / PA5 / / / PB0 / PA0 / PA1 | GND / PA11 / PA12 / PE15 / PE14 / PE13 / PE10 / PE9 / PC4 / PC5 / PC0 / PC1 / PB15 / PB14 / PD3 / PE6 / PE5 / PE4 / PE3 / PE2 | Module Carrier Board / / STM32L / / v1.2.0